# EAGLE schematic tmod-base (EAGLE 7.7.0)
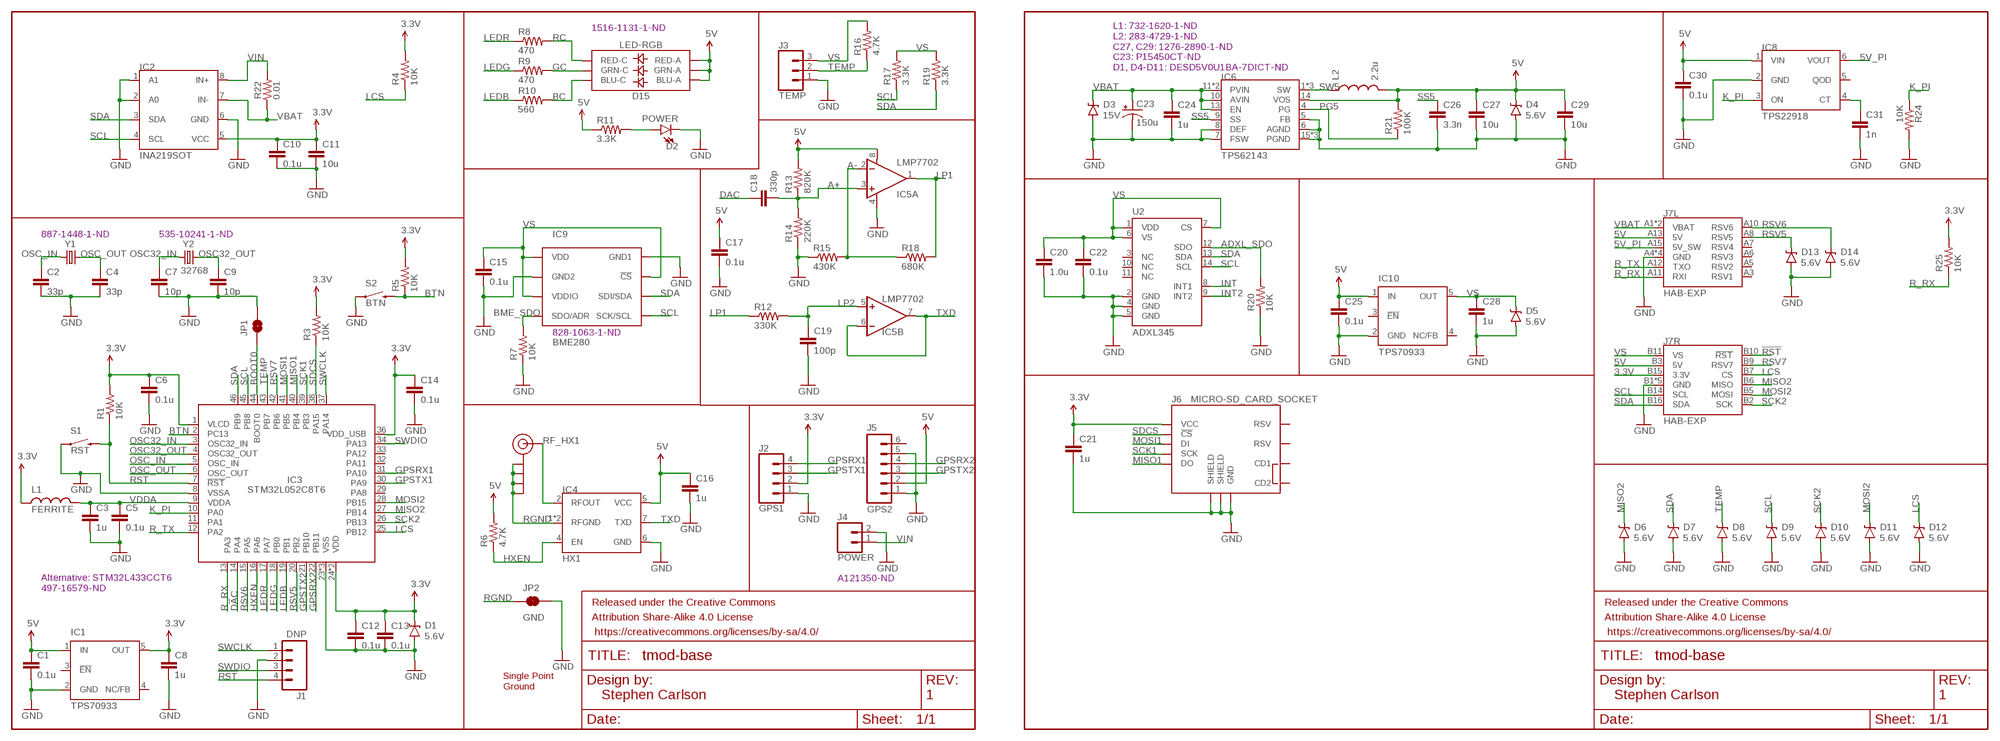
[diagram p0: schematic, sheet 1]

## Parts
C1  0.1u  CAP0805  [0805]
C2  33p  CAP0805  [0805]
C3  1u  CAP0805  [0805]
C4  33p  CAP0805  [0805]
C5  0.1u  CAP0805  [0805]
C6  0.1u  CAP0805  [0805]
C7  10p  CAP0805  [0805]
C8  1u  CAP0805  [0805]
C9  10p  CAP0805  [0805]
C10  0.1u  CAP0805  [0805]
C11  10u  CAP0805  [0805]
C12  0.1u  CAP0805  [0805]
C13  0.1u  CAP0805  [0805]
C14  0.1u  CAP0805  [0805]
C15  0.1u  CAP0805  [0805]
C16  1u  CAP0805  [0805]
C17  0.1u  CAP0805  [0805]
C18  330p  CAP0805  [0805]
C19  100p  CAP0805  [0805]
C20  1.0u  CAP0805  [0805]
C21  1u  CAP0805  [0805]
C22  0.1u  CAP0805  [0805]
C23  150u  CAP_POLE  [PANASONIC_E]
C24  1u  CAP0805  [0805]
C25  0.1u  CAP0805  [0805]
C26  3.3n  CAP0805  [0805]
C27  10u  CAP0805  [0805]
C28  1u  CAP0805  [0805]
C29  10u  CAP0805  [0805]
C30  0.1u  CAP0805  [0805]
C31  1n  CAP0805  [0805]
D1  5.6V  DIODE-ZENER5.6V  [SOD-323]
D2  POWER  LED-GREEN0603  [LED-0603]
D3  15V  DIODE-ZENER5.6V  [SOD-323]
D4  5.6V  DIODE-ZENER5.6V  [SOD-323]
D5  5.6V  DIODE-ZENER5.6V  [SOD-323]
D6  5.6V  DIODE-ZENER5.6V  [SOD-323]
D7  5.6V  DIODE-ZENER5.6V  [SOD-323]
D8  5.6V  DIODE-ZENER5.6V  [SOD-323]
D9  5.6V  DIODE-ZENER5.6V  [SOD-323]
D10  5.6V  DIODE-ZENER5.6V  [SOD-323]
D11  5.6V  DIODE-ZENER5.6V  [SOD-323]
D12  5.6V  DIODE-ZENER5.6V  [SOD-323]
D13  5.6V  DIODE-ZENER5.6V  [SOD-323]
D14  5.6V  DIODE-ZENER5.6V  [SOD-323]
D15  LED-RGB  [LED-TRICOLOR-5050]
FRAME1  FRAME-LETTERNO_PACKAGE  [DUMMY]
FRAME2  FRAME-LETTERNO_PACKAGE  [DUMMY]
IC1  TPS70933  TPS77033  [SOT23-DBV]
IC2  INA219SOT  [SOT23-8]
IC3  STM32L052C8T6  STM32L07C  [TQFP48]
IC4  HX1  [HX1]
IC5  LMP7702  LMP7702VSSOP  [VSSOP8]
IC6  TPS62143  TPS62140  [QFN16-3X3MM]
IC8  TPS22918  [SOT23-6L]
IC9  BME280  [BME280_LGA]
IC10  TPS70933  TPS77033  [SOT23-DBV]
J1  DNP  M04LOCK  [1X04_LOCK@1]
J2  GPS1  CONN_04JST-PTH  [JST-4-PTH]
J3  TEMP  CONN_03JST-PTH  [JST-3-PTH]
J4  POWER  1X02  [1X02_SCREW]
J5  GPS2  M06SMD-1MM  [1X06-1MM]
J6  MICRO-SD_CARD_SOCKET  [MICRO-SD-SOCKET]
J7  HAB-EXP  [HAB-EXP]
J$1  SMA_EDGE  [SMA-EDGE]
JP1  JUMPER-SMT_2_NC_TRACE_NO-SILK  [SMT-JUMPER_2_NC_TRACE_NO-SILK]
JP2  GND  JUMPER-PAD-2-NC_BY_TRACE  [PAD-JUMPER-2-NC_BY_TRACE_YES_SILK]
L1  FERRITE  INDUCTOR0805  [0805]
L2  2.2u  INDUCTORMPIA4012V2  [MPIA4012V2]
R1  10K  RESISTOR0805-RES  [0805]
R3  10K  RESISTOR0805-RES  [0805]
R4  10K  RESISTOR0805-RES  [0805]
R5  10K  RESISTOR0805-RES  [0805]
R6  4.7K  RESISTOR0805-RES  [0805]
R7  10K  RESISTOR0805-RES  [0805]
R8  470  RESISTOR0805-RES  [0805]
R9  470  RESISTOR0805-RES  [0805]
R10  560  RESISTOR0805-RES  [0805]
R11  3.3K  RESISTOR0805-RES  [0805]
R12  330K  RESISTOR0805-RES  [0805]
R13  820K  RESISTOR0805-RES  [0805]
R14  220K  RESISTOR0805-RES  [0805]
R15  430K  RESISTOR0805-RES  [0805]
R16  4.7K  RESISTOR0805-RES  [0805]
R17  3.3K  RESISTOR0805-RES  [0805]
R18  680K  RESISTOR0805-RES  [0805]
R19  3.3K  RESISTOR0805-RES  [0805]
R20  10K  RESISTOR0805-RES  [0805]
R21  100K  RESISTOR0805-RES  [0805]
R22  0.01  0.1OHM-1210-1/2W-1%  [1210]
R24  10K  RESISTOR0805-RES  [0805]
R25  10K  RESISTOR0805-RES  [0805]
S1  RST  SWITCH  [TACTILE-PTH-THIN]
S2  BTN  SWITCH  [TACTILE-PTH-THIN]
U2  ADXL345  [LGA14]
Y1  8M  CRYSTALTXC-7A  [CRYSTAL-TXC-7A]
Y2  32768  CRYSTAL  [ABS25]

## Nets
3.3V: C6.1 C8.1 C10.1 C11.1 C12.1 C13.1 C14.1 C21.1 D1.C IC1.5(OUT) IC2.5(VCC) IC3.1(VLCD) IC3.24(VDD) IC3.36(VDD_USB) IC3.48(VDD) J2.2 J6.VCC J7.B15(R:3.3V) L1.1 R1.2 R3.2 R4.2 R5.2 R25.2
5V: C1.1 C16.1 C17.1 C25.1 C27.1 C29.1 C30.1 D4.C D15.4(RED-A) D15.5(GRN-A) D15.6(BLU-A) IC1.1(IN) IC4.5(VCC) IC5.8(A:V+) IC6.14(VOS) IC8.1(VIN) IC10.1(IN) J5.2 J7.A13(L:5V) J7.B3(R:5V) L2.2 R6.2 R11.1 R13.2 R21.2
5V_PI: IC8.6(VOUT) J7.A15(L:5V_SW)
!RST!: IC3.7(!RST!) J1.4 J7.B10(R:!RST!) R1.1 S1.2
A+: C18.2 IC5.3(A:+IN) R13.1 R14.2
A-: IC5.2(A:-IN) R15.2 R18.1
ADXL_SDO: R20.2 U2.12(SDO)
BC: D15.1(BLU-C) R10.2
BME_SDO: IC9.P$5(SDO/ADR) R7.2
BOOT0: IC3.44(BOOT0) JP1.1
BTN: IC3.2(PC13) R5.1 S2.2
CT: C31.1 IC8.4(CT)
DAC: C18.1 IC3.14(PA4)
GC: D15.2(GRN-C) R9.2
GND: C1.2 C2.2 C3.2 C4.2 C5.2 C6.2 C7.2 C8.2 C9.2 C10.2 C11.2 C12.2 C13.2 C14.2 C15.2 C16.2 C17.2 C19.2 C20.2 C21.2 C22.2 C23.- C24.2 C25.2 C26.2 C27.2 C28.2 C29.2 C30.2 C31.2 D1.A D2.C D3.A D4.A D5.A D6.A D7.A D8.A D9.A D10.A D11.A D12.A D13.A D14.A IC1.2(GND) IC2.1(A1) IC2.2(A0) IC2.6(GND) IC3.8(VSSA) IC3.23(VSS) IC3.35(VSS) IC3.47(VSS) IC4.6(GND) IC5.4(A:V-) IC6.5(FB) IC6.6(AGND) IC6.7(FSW) IC6.8(DEF) IC6.15(PGND) IC6.16(PGND) IC6.EXT(PGND) IC8.2(GND) IC9.P$1(GND1) IC9.P$7(GND2) IC10.2(GND) J1.2 J2.1 J3.1 J4.2 J5.1 J5.5 J6.GND J6.GND1(SHIELD) J6.GND3(SHIELD) J7.A4(L:GND) J7.A9(L:GND) J7.A14(L:GND) J7.A16(L:GND) J7.B1(R:GND) J7.B4(R:GND) J7.B8(R:GND) J7.B12(R:GND) J7.B13(R:GND) JP1.2 JP2.2 R7.1 R14.1 R15.1 R20.1 R24.2 S1.1 S2.1 U2.2(GND) U2.4(GND) U2.5(GND)
GPSRX1: IC3.31(PA10) J2.4
GPSRX2: IC3.22(PB11) J5.4
GPSTX1: IC3.30(PA9) J2.3
GPSTX2: IC3.21(PB10) J5.3
HXEN: IC3.16(PA6) IC4.4(EN) R6.1
INT: U2.8(INT1)
INT2: U2.9(INT2)
K_PI: IC3.10(PA0) IC8.3(ON) R24.1
LCS: D12.C IC3.25(PB12) J7.B7(R:CS) R4.1
LEDB: IC3.19(PB1) R10.1
LEDG: IC3.18(PB0) R9.1
LEDR: IC3.17(PA7) R8.1
LP1: IC5.1(A:OUT) R12.1 R18.2
LP2: C19.1 IC5.5(B:+IN) R12.2
MISO1: IC3.40(PB4) J6.DO
MISO2: D6.C IC3.27(PB14) J7.B6(R:MISO)
MOSI1: IC3.41(PB5) J6.DI
MOSI2: D11.C IC3.28(PB15) J7.B5(R:MOSI)
OSC32_IN: C7.1 IC3.3(OSC32_IN) Y2.1
OSC32_OUT: C9.1 IC3.4(OSC32_OUT) Y2.4
OSC_IN: C2.1 IC3.5(OSC_IN) Y1.P$1
OSC_OUT: C4.1 IC3.6(OSC_OUT) Y1.P$2
PG5: IC6.4(PG) R21.1
PLED: D2.A R11.2
R_RX: IC3.13(PA3) J7.A11(L:RXI) R25.1
R_TX: IC3.12(PA2) J7.A12(L:TXO)
RC: D15.3(RED-C) R8.2
RF_HX1: IC4.2(RFOUT) J$1.SIG(SIGNAL)
RGND: IC4.1(RFGND) IC4.3(RFGND) J$1.GND@0(GND) J$1.GND@1(GND) J$1.GND@2(GND) J$1.GND@3(GND) JP2.1
RSV5: D13.C IC3.20(PB2) J7.A8(L:RSV5)
RSV6: D14.C IC3.15(PA5) J7.A10(L:RSV6)
RSV7: IC3.42(PB6) J7.B9(R:RSV7)
SCK1: IC3.39(PB3) J6.SCLK(SCK)
SCK2: D10.C IC3.26(PB13) J7.B2(R:SCK)
SCL: D9.C IC2.4(SCL) IC3.45(PB8) IC9.P$4(SCK/SCL) J7.B14(R:SCL) R17.1 U2.14(SCL)
SDA: D7.C IC2.3(SDA) IC3.46(PB9) IC9.P$3(SDI/SDA) J7.B16(R:SDA) R19.1 U2.13(SDA)
SDCS: IC3.38(PA15) J6.CS(!CS) R3.1
SS5: C26.1 IC6.9(SS)
SW5: IC6.1(SW) IC6.2(SW) IC6.3(SW) L2.1
SWCLK: IC3.37(PA14) J1.1
SWDIO: IC3.34(PA13) J1.3
TEMP: D8.C IC3.43(PB7) J3.2 R16.1
TXD: IC4.7(TXD) IC5.6(B:-IN) IC5.7(B:OUT)
VBAT: C23.+ C24.1 D3.C IC2.7(IN-) IC6.10(AVIN) IC6.11(PVIN) IC6.12(PVIN) IC6.13(EN) J7.A1(L:VBAT) J7.A2(L:VBAT) R22.1
VDDA: C3.1 C5.1 IC3.9(VDDA) L1.2
VIN: IC2.8(IN+) J4.1 R22.2
VS: C15.1 C20.1 C22.1 C28.1 D5.C IC9.P$2(!CS) IC9.P$6(VDDIO) IC9.P$8(VDD) IC10.5(OUT) J3.3 J7.B11(R:VS) R16.2 R17.2 R19.2 U2.1(VDD) U2.6(VS) U2.7(CS)
Unconnected: IC1.3(!EN) IC1.4(NC/FB) IC3.11(PA1) IC3.29(PA8) IC3.32(PA11) IC3.33(PA12) IC8.5(QOD) IC10.3(!EN) IC10.4(NC/FB) J5.6 J6.CD1 J6.CD2 J6.RSV1(RSV) J6.RSV2(RSV) J7.A3(L:RSV1) J7.A5(L:RSV2) J7.A6(L:RSV3) J7.A7(L:RSV4) U2.3(NC) U2.10(NC) U2.11(NC)

## Notes on the sheet
- 1516-1131-1-ND
- L1: 732-1620-1-ND
  L2: 283-4729-1-ND
  C27, C29: 1276-2890-1-ND
  C23: P15450CT-ND
  D1, D4-D11: DESD5V0U1BA-7DICT-ND
- 887-1448-1-ND | 535-10241-1-ND
- 828-1063-1-ND
- A121350-ND
- Alternative: STM32L433CCT6
  497-16579-ND
- Single Point
  Ground
- Stephen Carlson | 1 | Stephen Carlson | 1

## Library data of the parts
C1-C22 C24-C31 = SparkFun-Passives:CAP: Capacitor Standard 0603 ceramic capacitor, and 0.1" leaded capacitor.
C23 = SparkFun-Passives:CAP_POL: Capacitor Polarized These are standard SMD and PTH capacitors. Normally 10uF, 47uF, and 100uF in electrolytic and tantalum varieties. Always verify the external diameter of the through hole cap, it varies with capacity, voltage, and manufacturer. The EIA devices should be standard.
D1 D4-D14 = SparkFun-DiscreteSemi:DIODE-ZENER: Zener Diode Production Part - 8199 3.4V Zener Voltage; PROD_ID: DIO-12442
D2 = SparkFun-LED:LED-GREEN: Green SMD LED Used in manufacturing of various products at SparkFun Packages: 0603 - SMD 0603 package [Product Link] <http://www.futureelectronics.com/en/technologies/semiconductors/optoelectronics/leds/Pages/9894312-LTST-C190GKT.aspx?CrossPart=HSMG-C190&IM=0> LilyPad 1206 - SMD1206 LilyPad package [Product Link] <http://www.futureelectronics.com/en/Technologies/Product.aspx?ProductID=IN150NGHARVATEKCORPORATION2049943&IM=0> 1206 - SMD1206 package [Product Link] <http://www.futureelectronics.com/en/technologies/semiconductors/optoelectronics/leds/Pages/8315665-LTST-C150KGKT.aspx?IM=0> 1206 Bottom Mount -SMD 1206 Bottom Mount [Product Link] <http://www.digikey.com/product-detail/en/lite-on-inc/LTST-C230KGKT/160-1456-1-ND/386854> SparkFun Products: Pro Mini 328 -5V <https://www.sparkfun.com/products/821> RedBoard <https://www.sparkfun.com/products/12757> MP3 Trigger <https://www.sparkfun.com/products/13720> Makey Makey <https://www.sparkfun.com/products/11076>; PROD_ID: DIO-00821; VALUE: GREEN
D3 = SparkFun-DiscreteSemi:DIODE-ZENER: Zener Diode Production Part - 8199 3.4V Zener Voltage; PROD_ID: DIO-12442; VALUE: 5.6V
D15 = HAB:LED-RGB: RGB LED Digi-Key Part Number1516-1131-2-ND (QT Brightek QBLP679E-RGB)
FRAME1 FRAME2 = SparkFun-Aesthetics:FRAME-LETTER: Schematic Frame - Letter Standard 8.5x11 US Letter frame; DESIGNER: Nobody; VERSION: v01
IC1 IC10 = texas:TPS770*: ULTRALOW-POWER 50-mA LOW-DROPOUT LINEAR REGULATORS 50-mA Low-Dropout Regulator Source: http://focus.ti.com/lit/ds/symlink/tps77001.pdf; MF: TEXAS INSTRUMENTS; MPN: TPS77033DBVT; OC_FARNELL: 8461570; OC_NEWARK: 77C1187
IC2 = HAB:INA219: INA219 26-V, Bi-Directional, Zero-Drift, High-Side, I2C Out Current/Power Monitor
IC3 = stm32xx:STM32L07*C: STM32L07XC STM32L07X series in LQFP-48 package
IC4 = HAB:HX1: Radiometrix HX1 High-power VHF Narrow Band 300 mW Transmitter
IC5 = HAB:LMP7702: LMP7702 Precision, CMOS Input, RRIO, Wide Supply Range Amplifiers
IC6 = HAB:TPS62140: TPS62140/1/2/3 Adjustable or fixed output switch-mode 2A D-CAP2 regulator
IC8 = HAB:TPS22918: TPS22918 5.5-V, 2-A, 52-mΩOn-Resistance Load Switch
IC9 = BME280ComponentLibrary:BME280; PROD_ID: IC-13090
J1 = SparkFun-Connectors:M04: Header 4 Standard 4-pin 0.1" header. Use with straight break away headers (SKU : PRT-00116), right angle break away headers (PRT-00553), swiss pins (PRT-00743), machine pins (PRT-00117), and female headers (PRT-00115). Molex polarized connector foot print use with SKU : PRT-08231 with associated crimp pins and housings. 1MM SMD Version SKU: PRT-10208; PROD_ID: CONN-09696
J2 = SparkFun-Connectors:CONN_04: Multi connection point. Often used as Generic Header-pin footprint for 0.1 inch spaced/style header connections On any of the 0.1 inch spaced packages, you can populate with these: Break Away Headers - Straight <https://www.sparkfun.com/products/116> (PRT-00116) Break Away Male Headers - Right Angle <https://www.sparkfun.com/products/553> (PRT-00553) Female Headers <https://www.sparkfun.com/products/115> (PRT-00115) Break Away Headers - Machine Pin <https://www.sparkfun.com/products/117> (PRT-00117) Break Away Female Headers - Swiss Machine Pin <https://www.sparkfun.com/products/743> (PRT-00743) For SCREWTERMINALS and SPRING TERMINALS visit here: Screw Terimnals on SparkFun.com <https://www.sparkfun.com/search/results?term=Screw+Terminals> (5mm/3.5mm/2.54mm spacing) This device is also useful as a general connection point to wire up your design to another part of your project. Our various solder wires solder well into these plated through hole pads. Hook-Up Wire - Assortment (Stranded, 22 AWG) <https://www.sparkfun.com/products/11375> (PRT-11375) Hook-Up Wire - Assortment (Solid Core, 22 AWG) <https://www.sparkfun.com/products/11367> (PRT-11367) View the entire wire category on our website here <https://www.sparkfun.com/categories/141> Special notes: Molex polarized connector foot print use with SKU : PRT-08231 with associated crimp pins and housings. 1MM SMD Version SKU: PRT-10208; PROD_ID: WIRE-13531; SF_ID: PRT-09916
J3 = SparkFun-Connectors:CONN_03: Multi connection point. Often used as Generic Header-pin footprint for 0.1 inch spaced/style header connections On any of the 0.1 inch spaced packages, you can populate with these: Break Away Headers - Straight <https://www.sparkfun.com/products/116> (PRT-00116) Break Away Male Headers - Right Angle <https://www.sparkfun.com/products/553> (PRT-00553) Female Headers <https://www.sparkfun.com/products/115> (PRT-00115) Break Away Headers - Machine Pin <https://www.sparkfun.com/products/117> (PRT-00117) Break Away Female Headers - Swiss Machine Pin <https://www.sparkfun.com/products/743> (PRT-00743) Stackable Header - 3 Pin (Female, 0.1") <https://www.sparkfun.com/products/13875> (PRT-13875) For SCREWTERMINALS and SPRING TERMINALS visit here: Screw Terimnals on SparkFun.com <https://www.sparkfun.com/search/results?term=Screw+Terminals> (5mm/3.5mm/2.54mm spacing) This device is also useful as a general connection point to wire up your design to another part of your project. Our various solder wires solder well into these plated through hole pads. Hook-Up Wire - Assortment (Stranded, 22 AWG) <https://www.sparkfun.com/products/11375> (PRT-11375) Hook-Up Wire - Assortment (Solid Core, 22 AWG) <https://www.sparkfun.com/products/11367> (PRT-11367) View the entire wire category on our website here <https://www.sparkfun.com/categories/141> Special notes: Molex polarized connector foot print use with SKU : PRT-08232 with associated crimp pins and housings.; PROD_ID: WIRE-10037; SF_ID: PRT-09915
J4 = HAB:1X02: 1X02 1x2 header
J5 = SparkFun-Connectors:M06: Header 6 Standard 6-pin 0.1" header. Use with straight break away headers (SKU : PRT-00116), right angle break away headers (PRT-00553), swiss pins (PRT-00743), machine pins (PRT-00117), and female headers (PRT-00115). Molex polarized connector foot print use with SKU : PRT-08094 with associated crimp pins and housings. NOTES ON THE VARIANTS LOCK and LOCK_LONGPADS... This footprint was designed to help hold the alignment of a through-hole component (i.e. 6-pin header) while soldering it into place. You may notice that each hole has been shifted either up or down by 0.005 of an inch from it's more standard position (which is a perfectly straight line). This slight alteration caused the pins (the squares in the middle) to touch the edges of the holes. Because they are alternating, it causes a "brace" to hold the component in place. 0.005 has proven to be the perfect amount of "off-center" position when using our standard breakaway headers. Although looks a little odd when you look at the bare footprint, once you have a header in there, the alteration is very hard to notice. Also,if you push a header all the way into place, it is covered up entirely on the bottom side. This idea of altering the position of holes to aid alignment will be further integrated into the Sparkfun Library for other footprints. It can help hold any component with 3 or more connection pins.
J6 = SparkFun-Connectors:MICRO-SD_CARD_SOCKET: microSD Socket for Transflash Push-push type µSD socket. tDoc lines correctly indicate media card edge positions when inserting (unlocked, locked, depressed). NOTE: CD1 and CD2 are connected internally, and the default detect state of the socket is detect pin to ground. SparkFun Products: WAV Trigger <https://www.sparkfun.com/products/13660> CAN-Bus Shield <https://www.sparkfun.com/products/13262> SparkFun Level Shifing microSD Breakout <https://www.sparkfun.com/products/13743>; PROD_ID: CONN-07820; SF_ID: PRT-00127
J7 = HAB:HAB-EXP: HAB Expansion Connector Dual 2x8 expansion connectors for HAB project
J$1 = SparkFun-Connectors:SMA_EDGE: SMA Antenna Connector End launch SMA connector. The paste layer has been removed so that the connector can be hand soldered onto the board after reflow.
JP1 = SparkFun-Jumpers:JUMPER-SMT_2_NC_TRACE: Normally closed trace jumper This jumper has a trace between two pads so it's normally closed (NC). Use a razor knife to open the connection. For best results follow the IPC guidelines for cutting traces: Cutout at least 0.063 mm (0.005 in). Remove all loose material to clean up the cut area. Seal the cut with an approved epoxy. Reapply solder to reclose the connection.
JP2 = SparkFun-Passives:JUMPER-PAD-2-NC_BY_TRACE
L1 L2 = HAB:INDUCTOR: INDUCTOR Standard inductor, with some new packages Why do inductors never come in standard packages!?
R1 R3-R21 R24 R25 = SparkFun-Passives:RESISTOR: Resistor Basic schematic elements and footprints for 0603, 1206, and PTH resistors.
R22 = SparkFun-Resistors:0.1OHM: 0.1Ω resistor A resistor is a passive two-terminal electrical component that implements electrical resistance as a circuit element. Resistors act to reduce current flow, and, at the same time, act to lower voltage levels within circuits. - Wikipedia; PROD_ID: RES-12374; VALUE: 0.1
S1 S2 = HAB:SWITCH: SWITCH Package for the MJTP1250, a thinner and lighter PTH push button switch.
U2 = SparkFun-Sensors:ADXL345: 3-axis SPI/I2C 2/4/8/16g accelerometer
Y1 = SparkFun-FreqCtrl:CRYSTAL: Various standard crystals. Proven footprints.
Y2 = HAB:CRYSTAL: CRYSTAL Crystal oscillators in packages not in SparkFun-FreqCtl